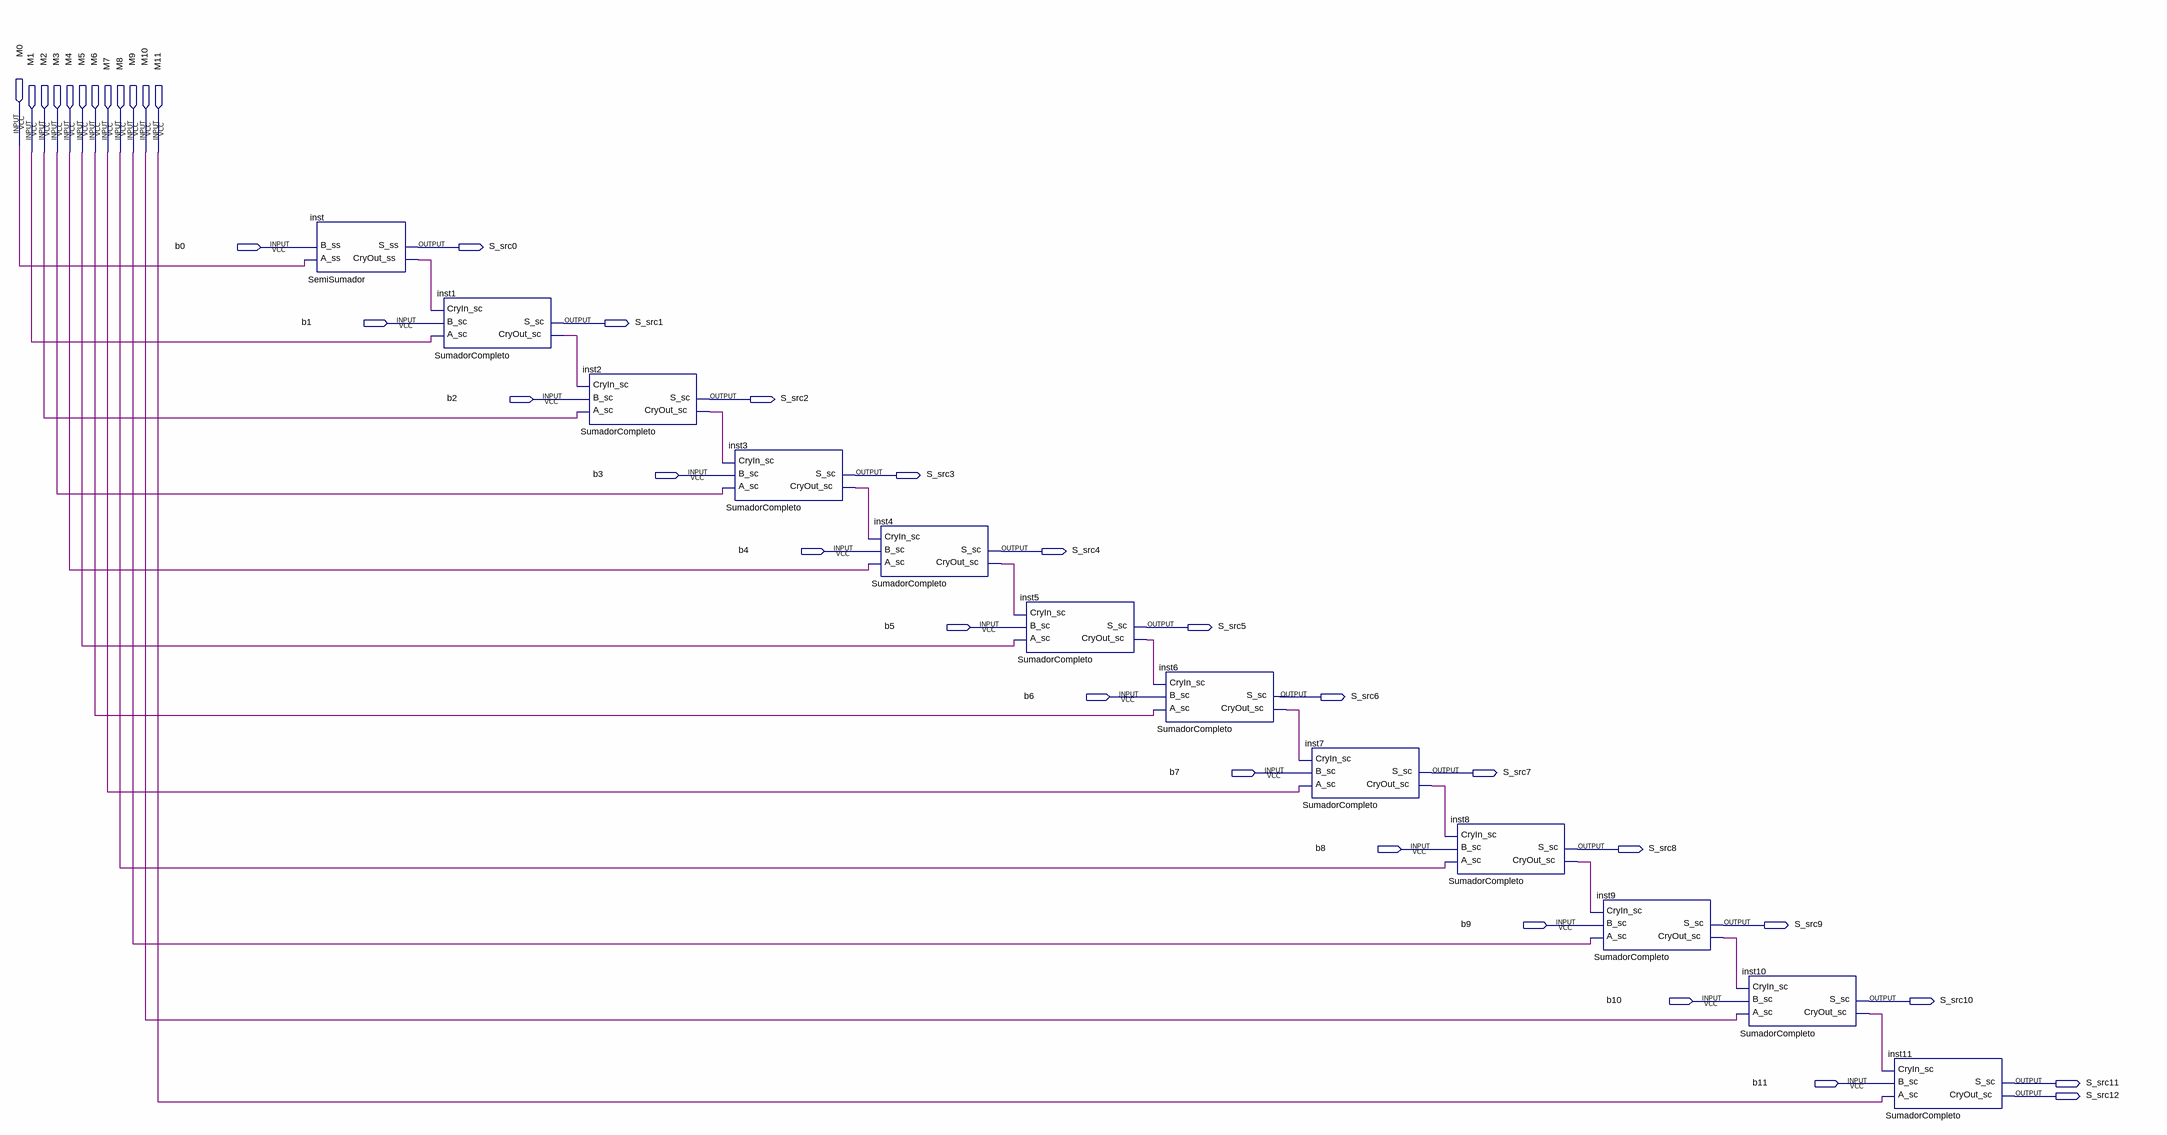
[diagram p0: schematic sheet]
// Quartus schematic SumadorReCompleto123.bdf as structural Verilog: 12 symbols, 37 pins
module SumadorReCompleto123 (
  input  M0,
  input  M1,
  input  M2,
  input  M3,
  input  M4,
  input  M5,
  input  M6,
  input  M7,
  input  M8,
  input  M9,
  input  M10,
  input  M11,
  input  b0,
  input  b1,
  input  b2,
  input  b3,
  input  b4,
  input  b5,
  input  b6,
  input  b7,
  input  b8,
  input  b9,
  input  b10,
  input  b11,
  output S_src0,
  output S_src1,
  output S_src2,
  output S_src3,
  output S_src4,
  output S_src5,
  output S_src6,
  output S_src7,
  output S_src8,
  output S_src9,
  output S_src10,
  output S_src11,
  output S_src12
);

  wire inst1_cryout_sc, inst2_cryout_sc, inst3_cryout_sc, inst4_cryout_sc, inst5_cryout_sc, inst6_cryout_sc,
       inst7_cryout_sc, inst8_cryout_sc, inst9_cryout_sc, inst10_cryout_sc, inst_cryout_ss;

  SemiSumador inst (.A_ss(M0), .B_ss(b0), .CryOut_ss(inst_cryout_ss), .S_ss(S_src0));
  SumadorCompleto inst1 (.A_sc(M1), .B_sc(b1), .CryIn_sc(inst_cryout_ss), .CryOut_sc(inst1_cryout_sc), .S_sc(S_src1));
  SumadorCompleto inst2 (.A_sc(M2), .B_sc(b2), .CryIn_sc(inst1_cryout_sc), .CryOut_sc(inst2_cryout_sc), .S_sc(S_src2));
  SumadorCompleto inst3 (.A_sc(M3), .B_sc(b3), .CryIn_sc(inst2_cryout_sc), .CryOut_sc(inst3_cryout_sc), .S_sc(S_src3));
  SumadorCompleto inst4 (.A_sc(M4), .B_sc(b4), .CryIn_sc(inst3_cryout_sc), .CryOut_sc(inst4_cryout_sc), .S_sc(S_src4));
  SumadorCompleto inst5 (.A_sc(M5), .B_sc(b5), .CryIn_sc(inst4_cryout_sc), .CryOut_sc(inst5_cryout_sc), .S_sc(S_src5));
  SumadorCompleto inst6 (.A_sc(M6), .B_sc(b6), .CryIn_sc(inst5_cryout_sc), .CryOut_sc(inst6_cryout_sc), .S_sc(S_src6));
  SumadorCompleto inst7 (.A_sc(M7), .B_sc(b7), .CryIn_sc(inst6_cryout_sc), .CryOut_sc(inst7_cryout_sc), .S_sc(S_src7));
  SumadorCompleto inst8 (.A_sc(M8), .B_sc(b8), .CryIn_sc(inst7_cryout_sc), .CryOut_sc(inst8_cryout_sc), .S_sc(S_src8));
  SumadorCompleto inst9 (.A_sc(M9), .B_sc(b9), .CryIn_sc(inst8_cryout_sc), .CryOut_sc(inst9_cryout_sc), .S_sc(S_src9));
  SumadorCompleto inst10 (
    .A_sc(M10), .B_sc(b10), .CryIn_sc(inst9_cryout_sc), .CryOut_sc(inst10_cryout_sc), .S_sc(S_src10));
  SumadorCompleto inst11 (.A_sc(M11), .B_sc(b11), .CryIn_sc(inst10_cryout_sc), .CryOut_sc(S_src12), .S_sc(S_src11));
endmodule
